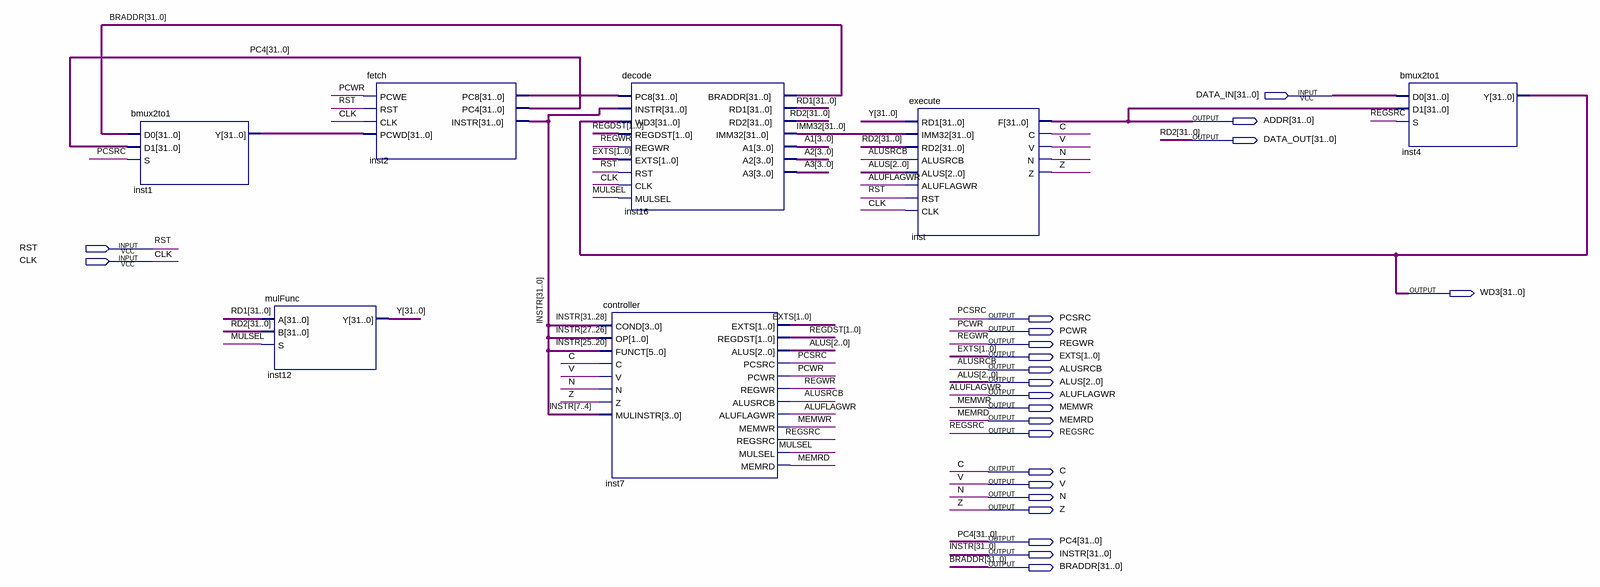
[diagram p0: schematic sheet]
// Quartus schematic SCP.bdf as structural Verilog: 7 symbols, 23 pins
module SCP (
  input  [31:0] DATA_IN,
  input  RST,
  input  CLK,
  output [31:0] ADDR,
  output [31:0] DATA_OUT,
  output [31:0] WD3,
  output PCSRC,
  output PCWR,
  output REGWR,
  output [1:0] EXTS,
  output ALUSRCB,
  output [2:0] ALUS,
  output ALUFLAGWR,
  output MEMWR,
  output MEMRD,
  output REGSRC,
  output C,
  output V,
  output N,
  output Z,
  output [31:0] PC4,
  output [31:0] INSTR,
  output [31:0] BRADDR
);

  wire MULSEL;
  wire [1:0] REGDST;
  wire [3:0] A1, A2, A3;
  wire [31:0] IMM32, inst1_y, inst2_pc8, RD1, Y;

  bmux2to1 inst1 (.D0(BRADDR), .D1(PC4), .S(PCSRC), .Y(inst1_y));
  mulFunc inst12 (.A(RD1), .B(DATA_OUT), .S(MULSEL), .Y(Y));
  fetch inst2 (.PCWE(PCWR), .RST(RST), .CLK(CLK), .PCWD(inst1_y), .PC8(inst2_pc8), .PC4(PC4), .INSTR(INSTR));
  controller inst7 (
    .COND(INSTR[31:28]), .OP(INSTR[27:26]), .FUNCT(INSTR[25:20]), .C(C), .V(V), .N(N), .Z(Z),
    .MULINSTR(INSTR[7:4]), .EXTS(EXTS), .REGDST(REGDST), .ALUS(ALUS), .PCSRC(PCSRC), .PCWR(PCWR),
    .REGWR(REGWR), .ALUSRCB(ALUSRCB), .ALUFLAGWR(ALUFLAGWR), .MEMWR(MEMWR), .REGSRC(REGSRC), .MULSEL(MULSEL),
    .MEMRD(MEMRD));
  decode inst16 (
    .PC8(inst2_pc8), .INSTR(INSTR), .WD3(WD3), .REGDST(REGDST), .REGWR(REGWR), .EXTS(EXTS), .RST(RST),
    .CLK(CLK), .MULSEL(MULSEL), .BRADDR(BRADDR), .RD1(RD1), .RD2(DATA_OUT), .IMM32(IMM32), .A1(A1), .A2(A2),
    .A3(A3));
  execute inst (
    .RD1(Y), .IMM32(IMM32), .RD2(DATA_OUT), .ALUSRCB(ALUSRCB), .ALUS(ALUS), .ALUFLAGWR(ALUFLAGWR), .RST(RST),
    .CLK(CLK), .F(ADDR), .C(C), .V(V), .N(N), .Z(Z));
  bmux2to1 inst4 (.D0(DATA_IN), .D1(ADDR), .S(REGSRC), .Y(WD3));

  // Other names for the same wires on the sheet: RD2[31:0] = DATA_OUT
endmodule
